# Altium project batteryAdapterBoard_r001.PrjPcb
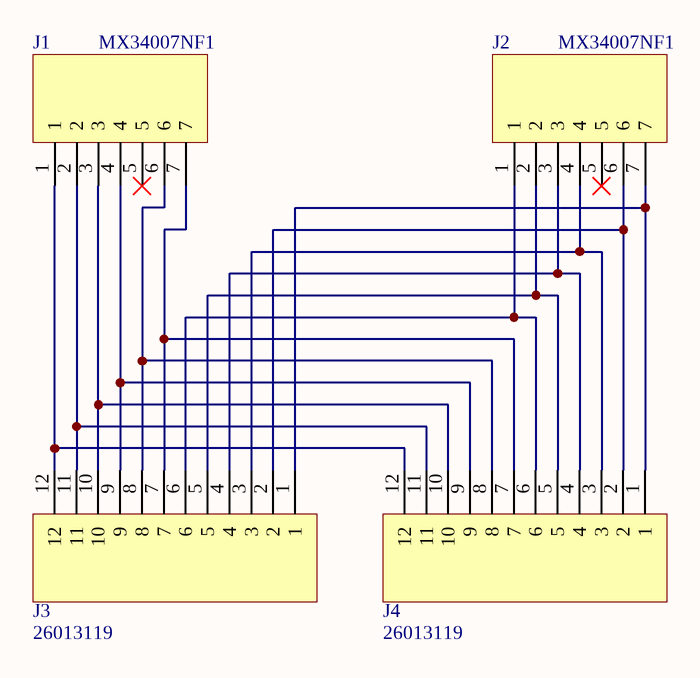
[diagram p0: batteryAdapterBoard_r001.SchDoc]
1 sheet, 4 parts. Net scope: global (net labels, ports and power ports of the same name join across sheets).
Board file: batteryAdapterBoard_r001.PcbDoc

## Sheet batteryAdapterBoard_r001.SchDoc
size A

### Parts
J1  MX34007NF1  [MX34007NF1]
J2  MX34007NF1  [MX34007NF1]
J3  26013119  [26013119]
J4  26013119  [26013119]

### Nets
NetJ1_1: J1.1 J3.12 J4.12
NetJ1_2: J1.2 J3.11 J4.11
NetJ1_3: J1.3 J3.10 J4.10
NetJ1_4: J1.4 J3.9 J4.9
NetJ1_6: J1.6 J3.8 J4.8
NetJ1_7: J1.7 J3.7 J4.7
NetJ2_1: J2.1 J3.6 J4.6
NetJ2_2: J2.2 J3.5 J4.5
NetJ2_3: J2.3 J3.4 J4.4
NetJ2_4: J2.4 J3.3 J4.3
NetJ2_6: J2.6 J3.2 J4.2
NetJ2_7: J2.7 J3.1 J4.1

Not connected (* = marked no-connect by the designer): J1 5*; J2 5*